# EasyEDA schematic HALF WAVE WITH WITHOUT FILTER PCB.json
TITLE: Sheet_1; REV: 1.0; Date: 2024-03-04; Sheet: 1/1; Drawn By: as7764; Company: Your Company
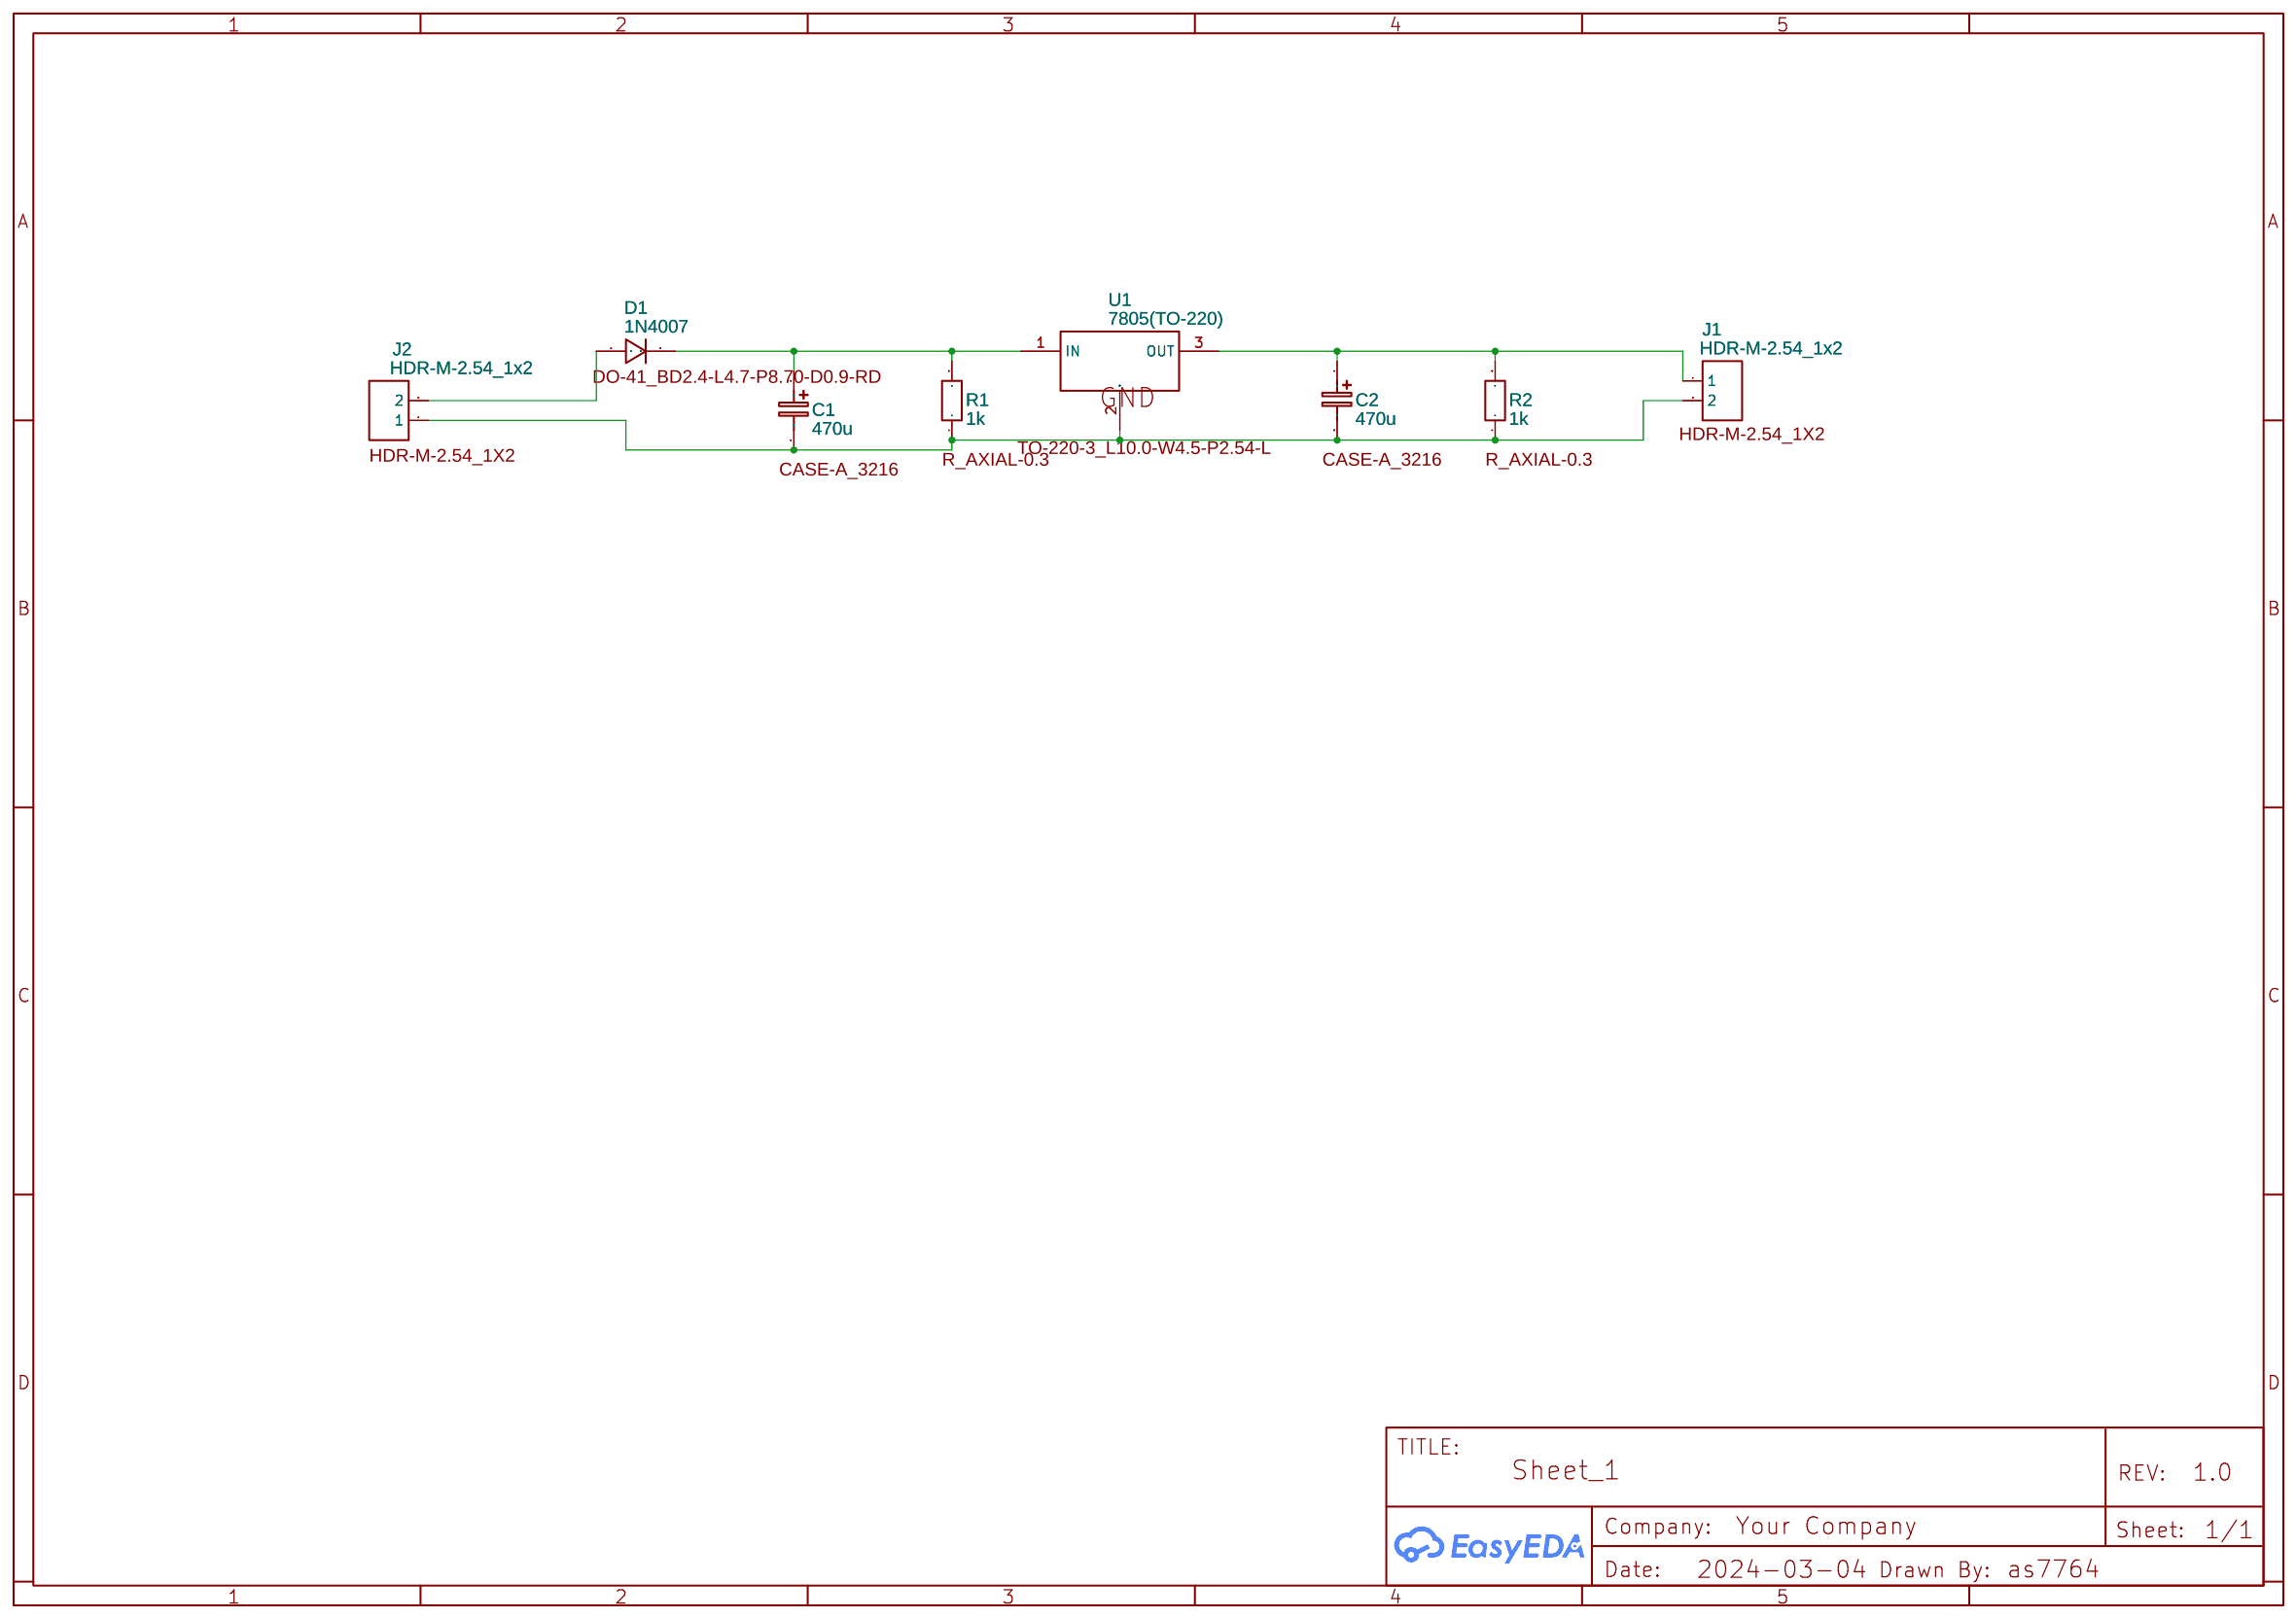
[diagram p0: schematic sheet]

## Parts
C1  470u  [CASE-A_3216]
C2  470u  [CASE-A_3216]
D1  1N4007  [DO-41_BD2.4-L4.7-P8.70-D0.9-RD]
J1  HDR-M-2.54_1x2  [HDR-M-2.54_1X2]
J2  HDR-M-2.54_1x2  [HDR-M-2.54_1X2]
R1  1k  [R_AXIAL-0.3]
R2  1k  [R_AXIAL-0.3]
U1  7805(TO-220)  [TO-220-3_L10.0-W4.5-P2.54-L]

## Library data of the parts
C1 C2 = C_Tan_SMD_A_EU: Contributor: LCEDA_Lib; Package Display: Yes
D1 = 1N4007: Supplier: LCSC; Manufacturer: SEMTECH; Supplier Part: C106903; Contributor: LCEDA_Lib; Package Display: Yes
J1 J2 = HDR-M-2.54_1x2: Supplier Part: C124375; Supplier: LCSC; Contributor: LCEDA_Lib; Package Display: Yes
R1 R2 = R_AXIAL-0.3_EU: Contributor: LCEDA_Lib; Package Display: Yes
U1 = 7805(TO-220): Supplier: LCSC; Manufacturer: STMicroelectronics; Manufacturer Part: L7805CV-DG; Supplier Part: C3795; Contributor: LCEDA_Lib; Package Display: Yes

## Nets
Net-(C1-1): C1.1 D1.1 R1.2 U1.1(IN)
Net-(C1-2): C1.2 C2.2 J1.2 J2.1 R1.1 R2.1 U1.2(GND)
Net-(C2-1): C2.1 J1.1 R2.2 U1.3(OUT)
Net-(D1-2): D1.2 J2.2
